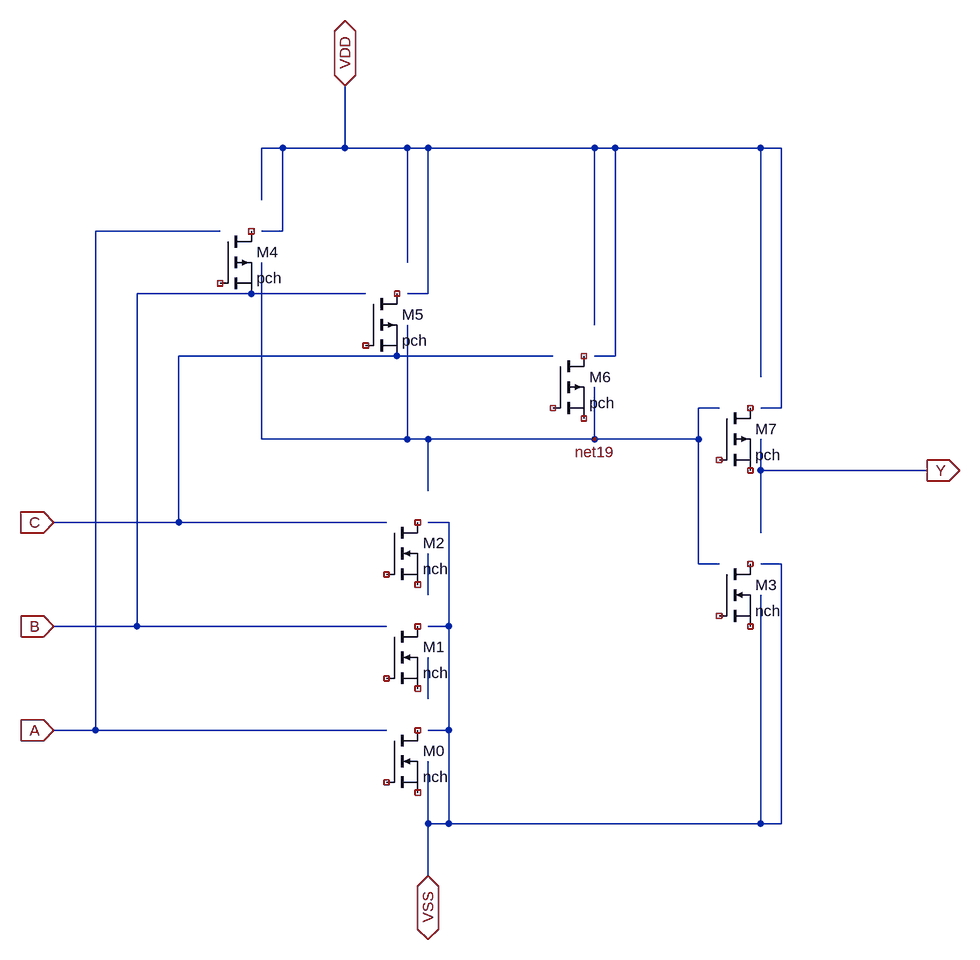
[diagram p0: schematic an31.asc]
an31.asc, the LTspice schematic file:
Version 4
SHEET 1 1520 1408
WIRE 672 880 672 816
WIRE 672 1040 672 976
WIRE 224 416 576 416
WIRE 224 928 224 416
WIRE 224 928 608 928
WIRE 96 928 224 928
WIRE 928 640 1088 640
WIRE 1088 640 1088 592
WIRE 1088 832 1120 832
WIRE 1088 832 1088 640
WIRE 1088 592 1120 592
WIRE 416 640 640 640
WIRE 672 640 928 640
WIRE 672 720 672 640
WIRE 640 640 640 464
WIRE 640 640 672 640
WIRE 416 640 416 368
WIRE 928 640 928 560
WIRE 544 192 544 96
WIRE 544 192 640 192
WIRE 928 192 960 192
WIRE 928 464 928 192
WIRE 1216 592 1216 192
WIRE 1184 192 1216 192
WIRE 1184 544 1184 192
WIRE 1184 592 1216 592
WIRE 672 192 928 192
WIRE 928 512 960 512
WIRE 448 320 448 192
WIRE 448 192 544 192
WIRE 416 320 448 320
WIRE 672 416 672 192
WIRE 640 416 672 416
WIRE 640 368 640 192
WIRE 640 192 672 192
WIRE 960 512 960 192
WIRE 416 192 448 192
WIRE 416 272 416 192
WIRE 960 192 1184 192
WIRE 672 1312 672 1232
WIRE 704 1232 1184 1232
WIRE 1184 1232 1184 880
WIRE 1184 1232 1216 1232
WIRE 1216 1232 1216 832
WIRE 1184 832 1216 832
WIRE 672 768 704 768
WIRE 704 928 704 768
WIRE 672 928 704 928
WIRE 704 1088 704 928
WIRE 672 1088 704 1088
WIRE 704 1232 704 1088
WIRE 672 1232 704 1232
WIRE 672 1232 672 1136
WIRE 288 512 864 512
WIRE 288 768 608 768
WIRE 288 768 288 512
WIRE 96 768 288 768
WIRE 160 320 352 320
WIRE 160 1088 160 320
WIRE 96 1088 160 1088
WIRE 160 1088 608 1088
WIRE 1184 688 1440 688
WIRE 1184 688 1184 640
WIRE 1184 784 1184 688
FLAG 928 640 net19
SYMBOL PMOS 1120 592 R0
SYMATTR InstName M7
SYMATTR Value pch
SYMATTR Value2 w=6u l=1u
SYMBOL PMOS 864 512 R0
SYMATTR InstName M6
SYMATTR Value pch
SYMATTR Value2 w=6u l=1u
SYMBOL PMOS 576 416 R0
SYMATTR InstName M5
SYMATTR Value pch
SYMATTR Value2 w=6u l=1u
SYMBOL PMOS 352 320 R0
SYMATTR InstName M4
SYMATTR Value pch
SYMATTR Value2 w=6u l=1u
SYMBOL NMOS 1120 832 R0
SYMATTR InstName M3
SYMATTR Value nch
SYMATTR Value2 w=2u l=1u
SYMBOL NMOS 608 768 R0
SYMATTR InstName M2
SYMATTR Value nch
SYMATTR Value2 w=4.7u l=1u
SYMBOL NMOS 608 928 R0
SYMATTR InstName M1
SYMATTR Value nch
SYMATTR Value2 w=4.7u l=1u
SYMBOL NMOS 608 1088 R0
SYMATTR InstName M0
SYMATTR Value nch
SYMATTR Value2 w=4.7u l=1u
FLAG 1440 688 Y
IOPIN 1440 688 Out
FLAG 672 1312 VSS
IOPIN 672 1312 BiDir
FLAG 544 96 VDD
IOPIN 544 96 BiDir
FLAG 96 768 C
IOPIN 96 768 In
FLAG 96 928 B
IOPIN 96 928 In
FLAG 96 1088 A
IOPIN 96 1088 In

The netlist it stands for:
* an31.asc
* M7: pch w=6u l=1u (symbol PMOS not certain, pin order unknown); nets seen at it: 
* M6: pch w=6u l=1u (symbol PMOS not certain, pin order unknown); nets seen at it: 
* M5: pch w=6u l=1u (symbol PMOS not certain, pin order unknown); nets seen at it: C
* M4: pch w=6u l=1u (symbol PMOS not certain, pin order unknown); nets seen at it: B
* M3: nch w=2u l=1u (symbol NMOS not certain, pin order unknown); nets seen at it: 
* M2: nch w=4.7u l=1u (symbol NMOS not certain, pin order unknown); nets seen at it: 
* M1: nch w=4.7u l=1u (symbol NMOS not certain, pin order unknown); nets seen at it: 
* M0: nch w=4.7u l=1u (symbol NMOS not certain, pin order unknown); nets seen at it: 
.backanno
.end